# Altium project 华南师范控制板.PrjPcb
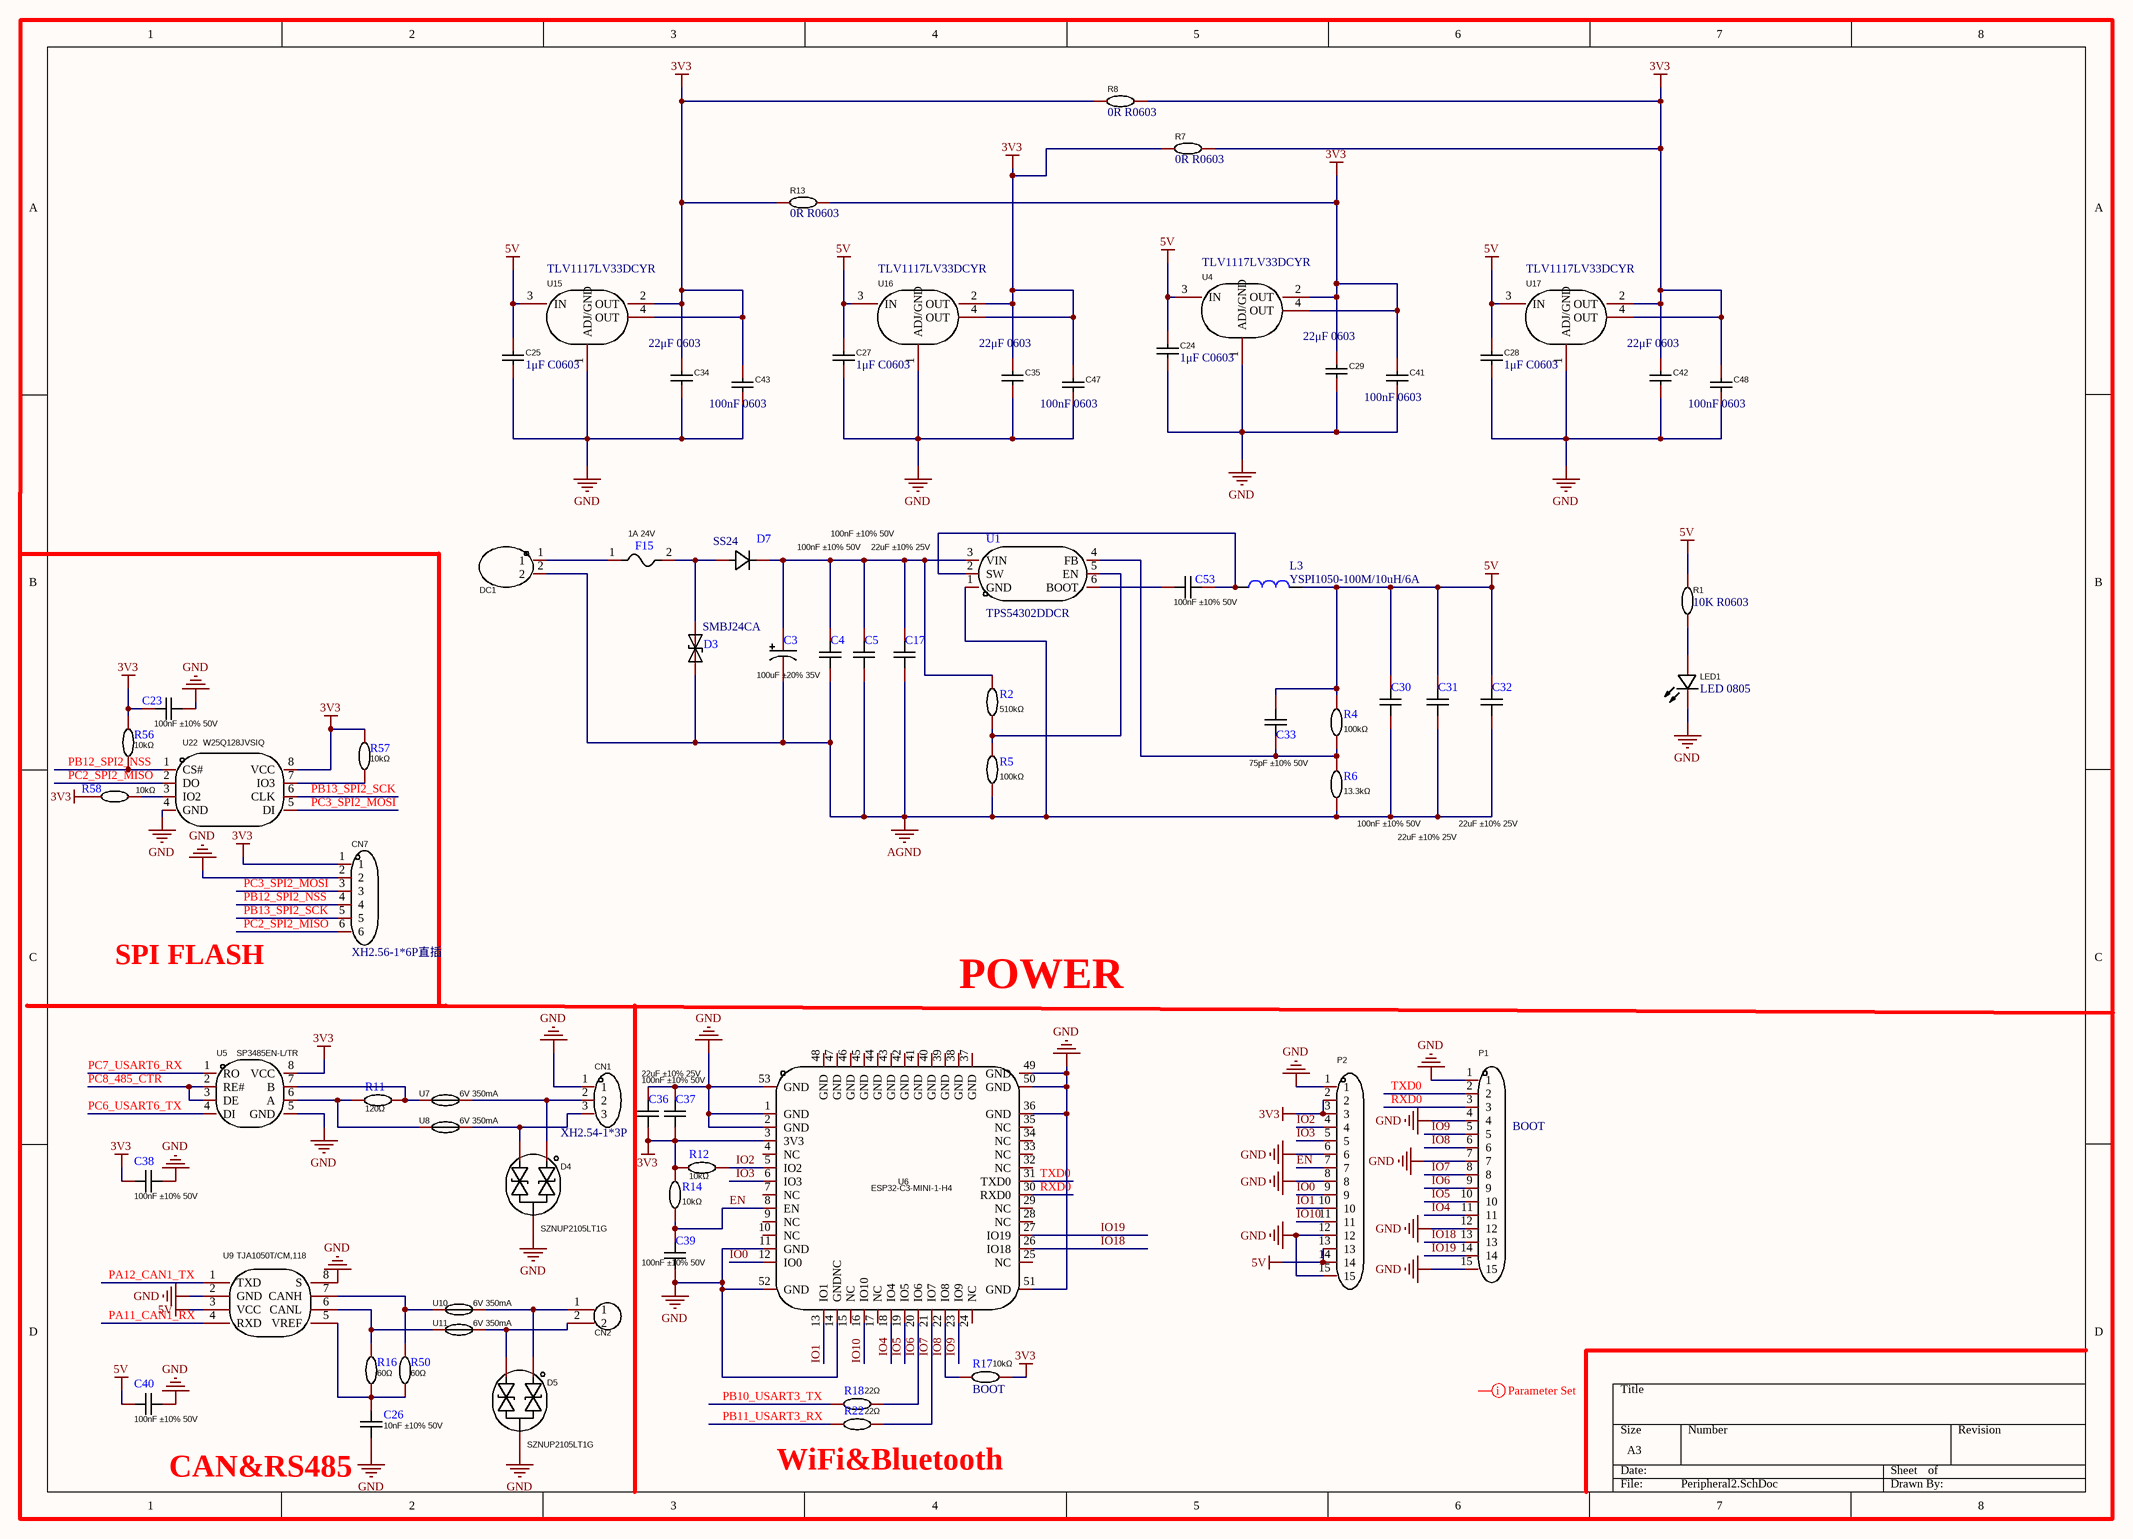
[diagram p0: Peripheral2.SchDoc]
2 sheets, 171 parts. Net scope: global (net labels, ports and power ports of the same name join across sheets).
Board files: MainMaster20230302.PcbDoc, 2.0原生完整板MainMaster20230302.PcbDoc, MainMaster20230708.PcbDoc
Sheets:
  Peripheral2.SchDoc
  MainMaster.SchDoc

## Sheet Peripheral2.SchDoc
size A3; PageSetup: Record=PageOptions|CenterHorizontal=True|CenterVertical=True|PrintScale=0.97|XCorrection=1.00|YCorrection=1.00|PrintKind=0|BorderSize=5000000|LeftOffset=0|BottomOffset=0|Orientation=2|PaperLength=1000|PaperWidth=1000|Scale=100|PaperSource=7|PrintQuality=-4|MediaType=1|DitherType=10|PrintScaleMode=1|PaperKind=A4|PaperIndex=9

### Parts
C3  LCSC Part Name: 100uF ±20% 35V  [CE 6.3*7.7]  (hidden comment: VES101M1VTR-0607)
C4  LCSC Part Name: 100nF ±10% 50V  [C0603]  (hidden comment: CC0603KRX7R9BB104)
C5  LCSC Part Name: 100nF ±10% 50V  [C0603]  (hidden comment: CC0603KRX7R9BB104)
C17  LCSC Part Name: 22uF ±10% 25V  [C1210]  (hidden comment: CC0603KRX7R9BB104)
C23  LCSC Part Name: 100nF ±10% 50V  [C0603]  (hidden comment: CC0603KRX7R9BB104)
C24  1μF C0603  [C0603]
C25  1μF C0603  [C0603]
C26  LCSC Part Name: 10nF ±10% 50V  [C0603]  (hidden comment: CC0603KRX7R9BB104)
C27  1μF C0603  [C0603]
C28  1μF C0603  [C0603]
C29  22μF 0603  [C0603]
C30  LCSC Part Name: 100nF ±10% 50V  [C0603]  (hidden comment: CC0603KRX7R9BB104)
C31  LCSC Part Name: 22uF ±10% 25V  [C1210]  (hidden comment: CC0603KRX7R9BB104)
C32  LCSC Part Name: 22uF ±10% 25V  [C1210]  (hidden comment: CC0603KRX7R9BB104)
C33  LCSC Part Name: 75pF ±10% 50V  [C0603]  (hidden comment: CC0603KRX7R9BB104)
C34  22μF 0603  [C0603]
C35  22μF 0603  [C0603]
C36  LCSC Part Name: 22uF ±10% 25V  [C1210]  (hidden comment: CC0603KRX7R9BB104)
C37  LCSC Part Name: 100nF ±10% 50V  [C0603]  (hidden comment: CC0603KRX7R9BB104)
C38  LCSC Part Name: 100nF ±10% 50V  [C0603]  (hidden comment: CC0603KRX7R9BB104)
C39  LCSC Part Name: 100nF ±10% 50V  [C0603]  (hidden comment: CC0603KRX7R9BB104)
C40  LCSC Part Name: 100nF ±10% 50V  [C0603]  (hidden comment: CC0603KRX7R9BB104)
C41  100nF 0603  [C0603]
C42  22μF 0603  [C0603]
C43  100nF 0603  [C0603]
C47  100nF 0603  [C0603]
C48  100nF 0603  [C0603]
C53  LCSC Part Name: 100nF ±10% 50V  [C0603]  (hidden comment: CC0603KRX7R9BB104)
CN1  XH2.54-1*3P  [XH2.54-1*3P-CONN-TH_3P-P2.50_HC-XH-3A-G]
CN2  XH-2A_C20079  [XH2.5-2]  (value not drawn)
CN7  XH2.56-1*6P直插  [H2.54-1*6P-直插CONN-TH_6P-P2.50_HC-XH-6A-G]
D3  SMBJ24CA  [SMB]
D4  SZNUP2105LT1G  [SOT-23]
D5  SZNUP2105LT1G  [SOT-23]
D7  SS24  [SMA]
DC1  A3963WV-2P  [CONN-TH_A3963WV-2P]  (value not drawn)
F15  LCSC Part Name: 1A 24V  [F1206]  (hidden comment: TLC-NSMD100/24)
L3  YSPI1050-100M/10uH/6A  [IND-SMD_L11.5-W10.0_SMMS1040]
LED1  LED 0805  [LED0805-RD_RED]
P1  KH-2.54FH-1X15P-H8.5  [HDR2.54-M-LI-15P]  (value not drawn)
P2  KH-2.54FH-1X15P-H8.5  [HDR2.54-M-LI-15P]  (value not drawn)
R1  10K R0603  [R0603]
R2  value 510kΩ  [R0603]  (hidden comment: 0603WAF5113T5E)
R4  value 100kΩ  [R0603]  (hidden comment: 0603WAF5113T5E)
R5  value 100kΩ  [R0603]  (hidden comment: 0603WAF5113T5E)
R6  value 13.3kΩ  [R0603]  (hidden comment: 0603WAF5113T5E)
R7  0R R0603  [R0603]
R8  0R R0603  [R0603]
R11  value 120Ω  [R0603]  (hidden comment: 0603WAF5113T5E)
R12  value 10kΩ  [R0603]  (hidden comment: 0603WAF5113T5E)
R13  0R R0603  [R0603]
R14  value 10kΩ  [R0603]  (hidden comment: 0603WAF5113T5E)
R16  value 60Ω  [R0603]  (hidden comment: 0603WAF5113T5E)
R17  value 10kΩ  [R0603]  (hidden comment: 0603WAF5113T5E)
R18  value 22Ω  [R0603]  (hidden comment: 0603WAF5113T5E)
R22  value 22Ω  [R0603]  (hidden comment: 0603WAF5113T5E)
R50  value 60Ω  [R0603]  (hidden comment: 0603WAF5113T5E)
R56  value 10kΩ  [R0603]  (hidden comment: 0603WAF5113T5E)
R57  value 10kΩ  [R0603]  (hidden comment: 0603WAF5113T5E)
R58  value 10kΩ  [R0603]  (hidden comment: 0603WAF5113T5E)
U1  TPS54302DDCR  [SOT23-6]
U4  TLV1117LV33DCYR  [1117LV-SOT-223_L6.7-W3.5-P2.30-BR]
U5  SP3485EN-L/TR  [SOP8_SP3485]
U6  ESP32-C3-MINI-1-H4  [WIFIM-SMD_ESP32-C3-MINI-1]
U7  LCSC Part Name: 6V 350mA  [F0603]  (hidden comment: 0603L035YR)
U8  LCSC Part Name: 6V 350mA  [F0603]  (hidden comment: 0603L035YR)
U9  TJA1050T/CM,118  [SOP8_TJA1050]
U10  LCSC Part Name: 6V 350mA  [F0603]  (hidden comment: 0603L035YR)
U11  LCSC Part Name: 6V 350mA  [F0603]  (hidden comment: 0603L035YR)
U15  TLV1117LV33DCYR  [1117LV-SOT-223_L6.7-W3.5-P2.30-BR]
U16  TLV1117LV33DCYR  [1117LV-SOT-223_L6.7-W3.5-P2.30-BR]
U17  TLV1117LV33DCYR  [1117LV-SOT-223_L6.7-W3.5-P2.30-BR]
U22  W25Q128JVSIQ  [SOIC8]

### Nets
3V3: C23.2 C29.2 C34.2 C35.2 C36.1 C37.1 C38.2 C41.2 C42.2 C43.2 C47.2 C48.2 CN7.1 P2.2 P2.3 R7.1 R7.2 R8.1 R8.2 R12.2 R13.1 R13.2 R14.2 R17.1 R56.1 R57.1 R58.2 U4.2(OUT) U4.4(OUT) U5.8(VCC) U6.3(3V3) U15.2(OUT) U15.4(OUT) U16.2(OUT) U16.4(OUT) U17.2(OUT) U17.4(OUT) U22.8(VCC)
5V: C24.2 C25.2 C27.2 C28.2 C30.2 C31.2 C32.2 C33.2 C40.2 L3.2 P2.13 P2.14 R1.2 R4.2 U4.3(IN) U9.3(VCC) U15.3(IN) U16.3(IN) U17.3(IN)
AGND: C3.2 C4.1 C5.1 C17.1 C23.1 C24.1 C25.1 C26.2 C27.1 C28.1 C29.1 C30.1 C31.1 C32.1 C34.1 C35.1 C36.2 C37.2 C38.1 C39.1 C40.1 C41.1 C42.1 C43.1 C47.1 C48.1 CN1.1 CN7.2 D3.2(A) D4.3 D5.3 DC1.2 LED1.1(-) P1.1 P1.4 P1.7 P1.12 P1.15 P2.1 P2.6 P2.8 P2.12 P2.15 R5.1 R6.1 U1.1(GND) U4.1(ADJ/GND) U5.5(GND) U6.1(GND) U6.2(GND) U6.11(GND) U6.14(GNDNC) U6.36(GND) U6.49(GND) U6.50(GND) U6.51(GND) U6.52(GND) U6.53(GND) U9.2(GND) U9.8(S) U15.1(ADJ/GND) U16.1(ADJ/GND) U17.1(ADJ/GND) U22.4(GND)  [also labelled GND]
EN: C39.2 P2.7 R14.1 U6.8(EN)
IO0: P2.9 U6.12(IO0)
IO1: P2.10 U6.13(IO1)
IO2: P2.4 R12.1 U6.5(IO2)
IO3: P2.5 U6.6(IO3)
IO4: P1.11 U6.18(IO4)
IO5: P1.10 U6.19(IO5)
IO6: P1.9 R18.1 U6.20(IO6)
IO7: P1.8 R22.1 U6.21(IO7)
IO8: P1.6 R17.2 U6.22(IO8)
IO9: P1.5 U6.23(IO9)
IO10: P2.11 U6.16(IO10)
IO18: P1.13 U6.26(IO18)
IO19: P1.14 U6.27(IO19)
PA11_CAN1_RX: U9.4(RXD)
PA12_CAN1_TX: U9.1(TXD)
PB10_USART3_TX: R18.2
PB11_USART3_RX: R22.2
PB12_SPI2_NSS: CN7.4 R56.2 U22.1(CS#)
PB13_SPI2_SCK: CN7.5 U22.6(CLK)
PC2_SPI2_MISO: CN7.6 U22.2(DO)
PC3_SPI2_MOSI: CN7.3 U22.5(DI)
PC6_USART6_TX: U5.4(DI)
PC7_USART6_RX: U5.1(RO)
PC8_485_CTR: U5.2(RE#) U5.3(DE)
RXD0: P1.3 U6.30(RXD0)
TXD0: P1.2 U6.31(TXD0)
NetC3_1: C3.1 C4.2 C5.2 C17.2 D7.1(K) R2.2 U1.3(VIN)
NetC26_1: C26.1 R16.2 R50.2 U9.5(VREF)
NetC33_1: C33.1 R4.1 R6.2 U1.4(FB)
NetC53_1: C53.1 L3.1 U1.2(SW)
NetC53_2: C53.2 U1.6(BOOT)
NetCN1_2: CN1.2 D4.1 U7.2
NetCN1_3: CN1.3 D4.2 U8.2
NetCN2_1: CN2.1 D5.1 U10.2
NetCN2_2: CN2.2 D5.2 U11.2
NetD3_1: D3.1(K) D7.2(A) F15.2
NetDC1_1: DC1.1 F15.1
NetLED1_2: LED1.2(+) R1.1
NetR2_1: R2.1 R5.2 U1.5(EN)
NetR11_1: R11.1 U5.7(B) U7.1
NetR11_2: R11.2 U5.6(A) U8.1
NetR16_1: R16.1 U9.6(CANL) U11.1
NetR50_1: R50.1 U9.7(CANH) U10.1
NetR57_2: R57.2 U22.7(IO3)
NetR58_1: R58.1 U22.3(IO2)

Not connected (* = marked no-connect by the designer): U6 4(NC) 7(NC) 9(NC) 10(NC) 15(NC) 17(NC) 24(NC) 25(NC) 28(NC) 29(NC) 32(NC) 33(NC) 34(NC) 35(NC) 37(GND) 38(GND) 39(GND) 40(GND) 41(GND) 42(GND) 43(GND) 44(GND) 45(GND) 46(GND) 47(GND) 48(GND)

### Notes on the sheet
- SPI FLASH
- POWER
- (near P1) BOOT
- (near R17) BOOT
- (near R22) WiFi&Bluetooth
- CAN&RS485

### Library data of the parts
C3 = VES101M1VTR-0607: Manufacturer: lelon(立隆); Name: 100uF; Add into BOM: yes; Value: 100uF; Tolerance: ±20%; Rated Voltage: 35V; φD: 6.3mm; L: 7.7mm; Lifetime @ Temp: 1000hrs@105℃; Symbol: VES101M1VTR-0607; Device: VES101M1VTR-0607; Supplier Part: C134792; Manufacturer Part: VES101M1VTR-0607; Supplier Footprint: SMD,6.3x7.7mm; JLCPCB Part Class: Extended Part; Datasheet: https://atta.szlcsc.com/upload/public/pdf/source/20171023/C134792_15087477404271052916.pdf; Supplier: LCSC; Convert to PCB: yes; Ripple Current: -; Equivalent Series Resistance(ESR): -; Operating Temperature: -45℃~+105℃
C4 C5 C17 C23 C26 C30-C33 C36-C40 C53 = CC0603KRX7R9BB104: Manufacturer: YAGEO(国巨); Name: 100nF; Add into BOM: yes; Value: 100nF; Tolerance: ±10%; Voltage Rated: 50V; Temperature Coefficient: X7R; Symbol: CC0603KRX7R9BB104; Device: CC0603KRX7R9BB104; Supplier Part: C14663; Manufacturer Part: CC0603KRX7R9BB104; Supplier Footprint: 0603; JLCPCB Part Class: Basic Part; Datasheet: https://atta.szlcsc.com/upload/public/pdf/source/20170116/1484561234239.pdf; Supplier: LCSC; Convert to PCB: yes
C24 C25 C27-C29 C34 C35 C42 = C0805: X7R/X5R，额定电压>=25,精度=10%; Manufacturer: FH(风华); Name: 100nF; Symbol: 0805B104K500NT; Add into BOM: yes; Value: 100nF; Tolerance: ±10%; Voltage Rated: 50V; Temperature Coefficient: X7R; Device: 0805B104K500NT; LCSC Part Name: 100nF ±10% 50V; Supplier Part: C38141; Manufacturer Part: 0805B104K500NT; Supplier Footprint: 0805; JLCPCB Part Class: Extended Part; Datasheet: https://atta.szlcsc.com/upload/public/pdf/source/20170923/C38141_1506149447419988747.pdf; Supplier: LCSC; Convert to PCB: yes
C41 C43 C47 C48 = C0805: X7R/X5R，额定电压>=25,精度=10%; Manufacturer: FH(风华); Symbol: 0805B104K500NT; Add into BOM: yes; Tolerance: ±10%; Voltage Rated: 50V; Temperature Coefficient: X7R; Name: 100nF; Device: 0805B104K500NT; LCSC Part Name: 100nF ±10% 50V; Supplier Part: C38141; Manufacturer Part: 0805B104K500NT; Supplier Footprint: 0805; JLCPCB Part Class: Extended Part; Datasheet: https://atta.szlcsc.com/upload/public/pdf/source/20170923/C38141_1506149447419988747.pdf; Supplier: LCSC; Convert to PCB: yes; Value: 100nF
CN1 = XH2.54-1*3P: 直插; Manufacturer: HCTL(华灿天禄); Name: HC-XH-3A-G; Add into BOM: yes; Reference Series: XH; Pitch: 2.54mm; Pins Structure: 1x3P; Number of PINs Per Row: 3; Gender: 公型插针; Current Rating (Max): 3A; Symbol: HC-XH-3A-G; Device: HC-XH-3A-G; LCSC Part Name: XH 2.54mm 1x3P 直插; Supplier Part: C5341202; Manufacturer Part: HC-XH-3A-G; Supplier Footprint: 插件,P=2.5mm; JLCPCB Part Class: Extended Part; Datasheet: https://atta.szlcsc.com/upload/public/pdf/source/20230105/4FFD2EFD3DA44AA828171A44400F3EDE.pdf; Supplier: LCSC; Convert to PCB: yes; Number of Rows: 1; Row Spacing: 2.54mm; Mounting Style: 直插; Operating Temperature Range: -25℃~+85℃; link: https://atta.szlcsc.com/upload/public/pdf/source/20230105/4FFD2EFD3DA44AA828171A44400F3EDE.pdf
CN2 = XH-2A_C20079: Manufacturer: BOOMELE(博穆精密); Name: XH-2A; Add into BOM: yes; Reference Series: XH; Pitch: 2.5mm; Pins Structure: 1x2P; Number of PINs Per Row: 2; Symbol: XH-2A; Device: XH-2A_C20079; LCSC Part Name: XH-2A,2P,脚距2.5mm,直插; Supplier Part: C20079; Manufacturer Part: XH-2A; Supplier Footprint: 插件,P=2.5mm; JLCPCB Part Class: Extended Part; Datasheet: https://atta.szlcsc.com/upload/public/pdf/source/20151225/1457707654857.pdf; Supplier: LCSC; Convert to PCB: yes; Number of Rows: 1; Row Spacing: -; Mounting Style: -; Contact Material: -
CN7 = XH2.56-1*6P直插: Manufacturer: HCTL(华灿天禄); Name: HC-XH-6AW-G; Add into BOM: yes; Reference Series: XH; Pitch: 2.54mm; Pins Structure: 1x6P; Number of PINs Per Row: 6; Gender: 公型插针; Current Rating (Max): 3A; Symbol: HC-XH-6AW-G; Device: HC-XH-6AW-G; LCSC Part Name: XH 2.54mm 1x6P 弯插; Supplier Part: C5341212; Manufacturer Part: HC-XH-6AW-G; Supplier Footprint: 弯插,P=2.5mm; Datasheet: https://atta.szlcsc.com/upload/public/pdf/source/20230105/4FFD2EFD3DA44AA828171A44400F3EDE.pdf; Supplier: LCSC; Convert to PCB: yes; Number of Rows: 1; Row Spacing: 2.54mm; Mounting Style: 弯插; Operating Temperature Range: -25℃~+85℃
D3 = SMBJ24CA_C78416: Manufacturer: Brightking(君耀电子); Add into BOM: yes; Polarity: 双向; Reverse Stand-Off Voltage (Vrwm): 24V; Breakdown Voltage (Min): 26.7V; Peak Pulse Current (Ipp)@10/1000μs: 15.5A; Maximum Clamping Voltage: 38.9V; Name: SMBJ24CA; Symbol: SMBJ24CA_C78416; Device: SMBJ24CA_C78416; LCSC Part Name: 双向 Vrwm:24V; Supplier Part: C78416; Manufacturer Part: SMBJ24CA; Supplier Footprint: SMB(DO-214AA); JLCPCB Part Class: Extended Part; Datasheet: https://atta.szlcsc.com/upload/public/pdf/source/20160709/1468031885392.pdf; Supplier: LCSC; Convert to PCB: yes
D4 D5 = SZNUP2105LT1G: Manufacturer: onsemi(安森美); Add into BOM: yes; Name: SZNUP2105LT1G; Symbol: SZNUP2105LT1G; Device: SZNUP2105LT1G; LCSC Part Name: SZNUP2105LT1G; Supplier Part: C233494; Manufacturer Part: SZNUP2105LT1G; Supplier Footprint: SOT-23-3; JLCPCB Part Class: Extended Part; Datasheet: https://atta.szlcsc.com/upload/public/pdf/source/20180829/C233494_96D7515346DCD494B58AEC5F0195E5EF.pdf; Supplier: LCSC; Convert to PCB: yes
D7 = SS24_C2829443: Manufacturer: CJ(江苏长电/长晶); Add into BOM: yes; Diode Configuration: 独立式; Reverse Voltage (Vr): 40V; Average Rectified Current (Io): 2A; Forward Voltage (Vf@If): 550mV@2A; Reverse Leakage Current (Ir): 500uA@40V; Name: SS24; Symbol: SS24_C2829443; Device: SS24_C2829443; LCSC Part Name: 40V 2A 550mV@2A; Supplier Part: C2829443; Manufacturer Part: SS24; Supplier Footprint: SMAG; JLCPCB Part Class: Extended Part; Datasheet: https://atta.szlcsc.com/upload/public/pdf/source/20211215/D3A84FE1ADED5816729B4A876C7DC644.pdf; Supplier: LCSC; Convert to PCB: yes
DC1 = A3963WV-2P: Manufacturer: CJT(长江连接器); Add into BOM: yes; Reference Series: VH; Pitch: 3.96mm; Pins Structure: 1x2P; Number of PINs Per Row: 2; Name: A3963WV-2P; Symbol: A3963WV-2P; Device: A3963WV-2P; LCSC Part Name: VH 3.96mm 1x2P; Supplier Part: C239409; Manufacturer Part: A3963WV-2P; Supplier Footprint: 插件,P=3.96mm; JLCPCB Part Class: Extended Part; Datasheet: https://atta.szlcsc.com/upload/public/pdf/source/20230105/6EEAD9731438ED12835B23C71AA3398A.pdf; Supplier: LCSC; Convert to PCB: yes; Number of Rows: 1; Row Spacing: -; Mounting Style: -; Contact Material: 黄铜
F15 = TLC-NSMD100/24: Manufacturer: TLC(竞沃); Add into BOM: yes; Operating Voltage (Max): 24V; Current Rating (Max): 100A; Hold Current: 1A; Trip Current: 2A; Power Dissipation: 600mW; Resistance - Initial (Ri) (Min): 60mΩ; Resistance - Post Trip (R1) (Max): 280mΩ; Maximum Time to Trip: 100ms; Name: TLC-NSMD100/24; Symbol: TLC-NSMD100/24; Device: TLC-NSMD100/24; Supplier Part: C2924939; Manufacturer Part: TLC-NSMD100/24; Supplier Footprint: 1206; JLCPCB Part Class: Extended Part; Datasheet: https://atta.szlcsc.com/upload/public/pdf/source/20211202/9DD64AE932171F6A930B1738394E7F41.pdf; Supplier: LCSC; Convert to PCB: yes; Operating Temperature: -
L3 = INDUCTOR
LED1 = LED 0805: LED 0805-NCD0805R1; Manufacturer: 国星光电; Symbol: FC-2012HRK-620D; Add into BOM: yes; Illumination Color: 红色; Luminous Intensity (IF=20mA): 67~195mcd; Dominant Wavelength / Coordinate rank: 615~630nm; Name: NCD0805R1; Device: NCD0805R1; LCSC Part Name: 红灯 0805 贴片LED; Supplier Part: C84256; Manufacturer Part: NCD0805R1; Supplier Footprint: 0805; JLCPCB Part Class: Basic Part; Datasheet: https://atta.szlcsc.com/upload/public/pdf/source/20200820/C84256_F0A75A43B3EAD75808600A0514C76B99.pdf; Supplier: LCSC; Convert to PCB: yes; Mounting Type: 表面贴装
P1 P2 = KH-2.54FH-1X15P-H8.5: Manufacturer: kinghelm(金航标); Add into BOM: yes; Pitch: 2.54mm; Number of Holes: 15; Holes Structure: 1x15P; Circular Hole / Square Hole: 方孔; Current Rating (Max): 3A; Holes Direction: 顶部; Name: KH-2.54FH-1X15P-H8.5; Symbol: KH-2.54FH-1X15P-H8.5; Device: KH-2.54FH-1X15P-H8.5; LCSC Part Name: 2.54mm 1x15P; Supplier Part: C2932676; Manufacturer Part: KH-2.54FH-1X15P-H8.5; Supplier Footprint: 直插,P=2.54mm; JLCPCB Part Class: Extended Part; Datasheet: https://atta.szlcsc.com/upload/public/pdf/source/20211220/977AA415CFA981E866620A80068F25CA.pdf; Supplier: LCSC; Convert to PCB: yes; Number of Rows: 1; Row Spacing: -; Mounting Type: 直插; Voltage Rating (Max): -; Insulation Height: 8.5mm; Operating Temperature Range: -40℃~+105℃
R1 R7 R8 R13 = R0603: Manufacturer: YAGEO(国巨); Name: 68Ω; Symbol: RC0805FR-0768RL; Add into BOM: yes; Value: 68Ω; Tolerance: ±1%; Power(Watts): 125mW; Temperature Coefficient: ±100ppm/℃; Overload Voltage (Max): 150V; Device: RC0805FR-0768RL; LCSC Part Name: 68Ω ±1% 125mW; Supplier Part: C137498; Manufacturer Part: RC0805FR-0768RL; Supplier Footprint: 0805; JLCPCB Part Class: Extended Part; Datasheet: https://atta.szlcsc.com/upload/public/pdf/source/20171106/C137498_15099604779991093655.pdf; Supplier: LCSC; Convert to PCB: yes; Type: 厚膜电阻; Operating Temperature Range: -55℃~+125℃
R2 R4-R6 R11 R12 R14 R16-R18 R22 R50 R56-R58 = 0603WAF5113T5E: Manufacturer: UNI-ROYAL(厚声); Add into BOM: yes; Tolerance: ±1%; Power(Watts): 100mW; Temperature Coefficient: ±100ppm/℃; Overload Voltage (Max): 75V; Symbol: 0603WAF5113T5E; Device: 0603WAF5113T5E; LCSC Part Name: 511kΩ ±1% 100mW; Supplier Part: C23194; Manufacturer Part: 0603WAF5113T5E; Supplier Footprint: 0603; JLCPCB Part Class: Extended Part; Datasheet: https://atta.szlcsc.com/upload/public/pdf/source/20200306/C422600_1E6D84923E4A46A82E41ADD87F860B5C.pdf; Supplier: LCSC; Convert to PCB: yes; Type: 厚膜电阻; Operating Temperature Range: -55℃~+155℃
  R2: Name: 510kΩ
  R4 R5: Name: 100kΩ
  R6: Name: 13.3kΩ
  R11: Name: 120Ω
  R12 R14 R17 R56-R58: Name: 10kΩ
  R16 R50: Name: 60Ω
  R18 R22: Name: 22Ω
U1 = TPS54302DDCR: Manufacturer: TI(德州仪器); Symbol: TPS54302DDCR_C311983; Add into BOM: yes; Function: 降压型; Synchronous Rectification: 是; Output Type: 可调; Number of Outputs: 1; Topology: 降压式; Input Voltage: 4.5V~28V; Output Voltage: 596mV~28V; Output Current (Max): 3A; Switching Frequency: 400kHz; Name: TPS54302DDCR; Device: TPS54302DDCR; LCSC Part Name: 降压型 Vin=4.5V~28V Vout=596mV~28V 3A; Supplier Part: C311983; Manufacturer Part: TPS54302DDCR; Supplier Footprint: TSOT-23-6; JLCPCB Part Class: Extended Part; Datasheet: https://atta.szlcsc.com/upload/public/pdf/source/20181023/C311983_0948EE70BFAD2011B492BD3F4CEA709D.pdf; Supplier: LCSC; Convert to PCB: yes; Operating Temperature: -40℃~+125℃@(TJ)
U4 U15-U17 = TLV1117LV33DCYR: C15578 // SOT-223// TI; Manufacturer: TI(德州仪器); Add into BOM: yes; Output Type: 固定; Output Polarity: 正; Number of Outputs: 1; Maximum Input Voltage: 5.5V; Output Voltage: 3.3V; Dropout Voltage: 1.3V@(800mA); Output Current: 1A; Power Supply Rejection Ratio (PSRR): 75dB@(120Hz); Name: TLV1117LV33DCYR; Symbol: TLV1117LV33DCYR; Device: TLV1117LV33DCYR; LCSC Part Name: 正 Vin=5.5V Vout=3.3V 1A 75dB@(120Hz); Supplier Part: C15578; Manufacturer Part: TLV1117LV33DCYR; Supplier Footprint: SOT-223; JLCPCB Part Class: Extended Part; Datasheet: https://atta.szlcsc.com/upload/public/pdf/source/20140704/1457707105729.pdf; Supplier: LCSC; Convert to PCB: yes
U5 = SP3485EN-L/TR: Manufacturer: MaxLinear; Add into BOM: yes; Types: 收发器; Driver/receiver: 1/1; Data Rate: 10Mbps; Supply Voltage: 3.3V; Name: SP3485EN-L/TR; Symbol: SP3485EN-L/TR; Device: SP3485EN-L/TR; LCSC Part Name: 10Mbps; Supplier Part: C8963; Manufacturer Part: SP3485EN-L/TR; Supplier Footprint: SOIC-8_150mil; JLCPCB Part Class: Basic Part; Datasheet: https://atta.szlcsc.com/upload/public/pdf/source/20170601/1496285796963.pdf; Supplier: LCSC; Convert to PCB: yes
U6 = ESP32-C3-MINI-1U-H4: Manufacturer: ESPRESSIF(乐鑫); Add into BOM: yes; Name: ESP32-C3-MINI-1-H4; Symbol: ESP32-C3-MINI-1-H4; Device: ESP32-C3-MINI-1-H4; LCSC Part Name: ESP32-C3-MINI-1-H4; Supplier Part: C2934569; Manufacturer Part: ESP32-C3-MINI-1-H4; Supplier Footprint: 模块; JLCPCB Part Class: Extended Part; Datasheet: https://atta.szlcsc.com/upload/public/pdf/source/20220602/2F3F799AD033675D9930B69B0B580EA8.pdf; Supplier: LCSC; Convert to PCB: yes
U7 U8 U10 U11 = 0603L035YR: Manufacturer: Littelfuse(美国力特); Add into BOM: yes; Operating Voltage (Max): 6V; Current Rating (Max): 40A; Hold Current: 350mA; Trip Current: 750mA; Resistance - Initial (Ri) (Min): 200mΩ; Resistance - Post Trip (R1) (Max): 1Ω; Maximum Time to Trip: 100ms; Name: 0603L035YR; Symbol: 0603L035YR; Device: 0603L035YR; Supplier Part: C207013; Manufacturer Part: 0603L035YR; Supplier Footprint: 0603; JLCPCB Part Class: Extended Part; Datasheet: https://atta.szlcsc.com/upload/public/pdf/source/20180709/C207013_44786F09EAFC890D8A7C29FA56404C7F.pdf; Supplier: LCSC; Convert to PCB: yes; Power Dissipation: -; Operating Temperature: -40℃~+85℃
U9 = TJA1050T/CM,118: Manufacturer: NXP(恩智浦); Add into BOM: yes; Protocol: CAN总线; Supply Voltage: 4.75V ~ 5.25V; Name: TJA1050T/CM,118; Symbol: TJA1050T/CM,118; Device: TJA1050T/CM,118; LCSC Part Name: TJA1050T/CM,118; Supplier Part: C6952; Manufacturer Part: TJA1050T/CM,118; Supplier Footprint: SOIC-8_150mil; JLCPCB Part Class: Basic Part; Datasheet: https://atta.szlcsc.com/upload/public/pdf/source/20140411/1457707042917.pdf; Supplier: LCSC; Convert to PCB: yes; Type: 收发器
U22 = W25Q128JVSIQ: Manufacturer: WINBOND(华邦); Symbol: W25Q128JVSIQTR; Add into BOM: yes; Memory Format: FLASH; Memory Interface: SPI - Dual/Quad I/O; Memory Size: 128Mb (16M x 8); Voltage - Supply: 2.7V ~ 3.6V; Name: W25Q128JVSIQ; Device: W25Q128JVSIQ; LCSC Part Name: W25Q128JVSIQ; Supplier Part: C97521; Manufacturer Part: W25Q128JVSIQ; Supplier Footprint: SOIC-8_208mil; JLCPCB Part Class: Basic Part; Datasheet: https://atta.szlcsc.com/upload/public/pdf/source/20170316/1489627409956.pdf; Supplier: LCSC; Convert to PCB: yes

## Sheet MainMaster.SchDoc
size A3; PageSetup: Record=PageOptions|CenterHorizontal=True|CenterVertical=True|PrintScale=0.71|XCorrection=1.00|YCorrection=1.00|PrintKind=0|BorderSize=5000000|LeftOffset=0|BottomOffset=0|Orientation=2|PaperLength=1000|PaperWidth=1000|Scale=100|PaperSource=7|PrintQuality=-4|MediaType=1|DitherType=10|PrintScaleMode=1|PaperKind=A4|PaperIndex=9
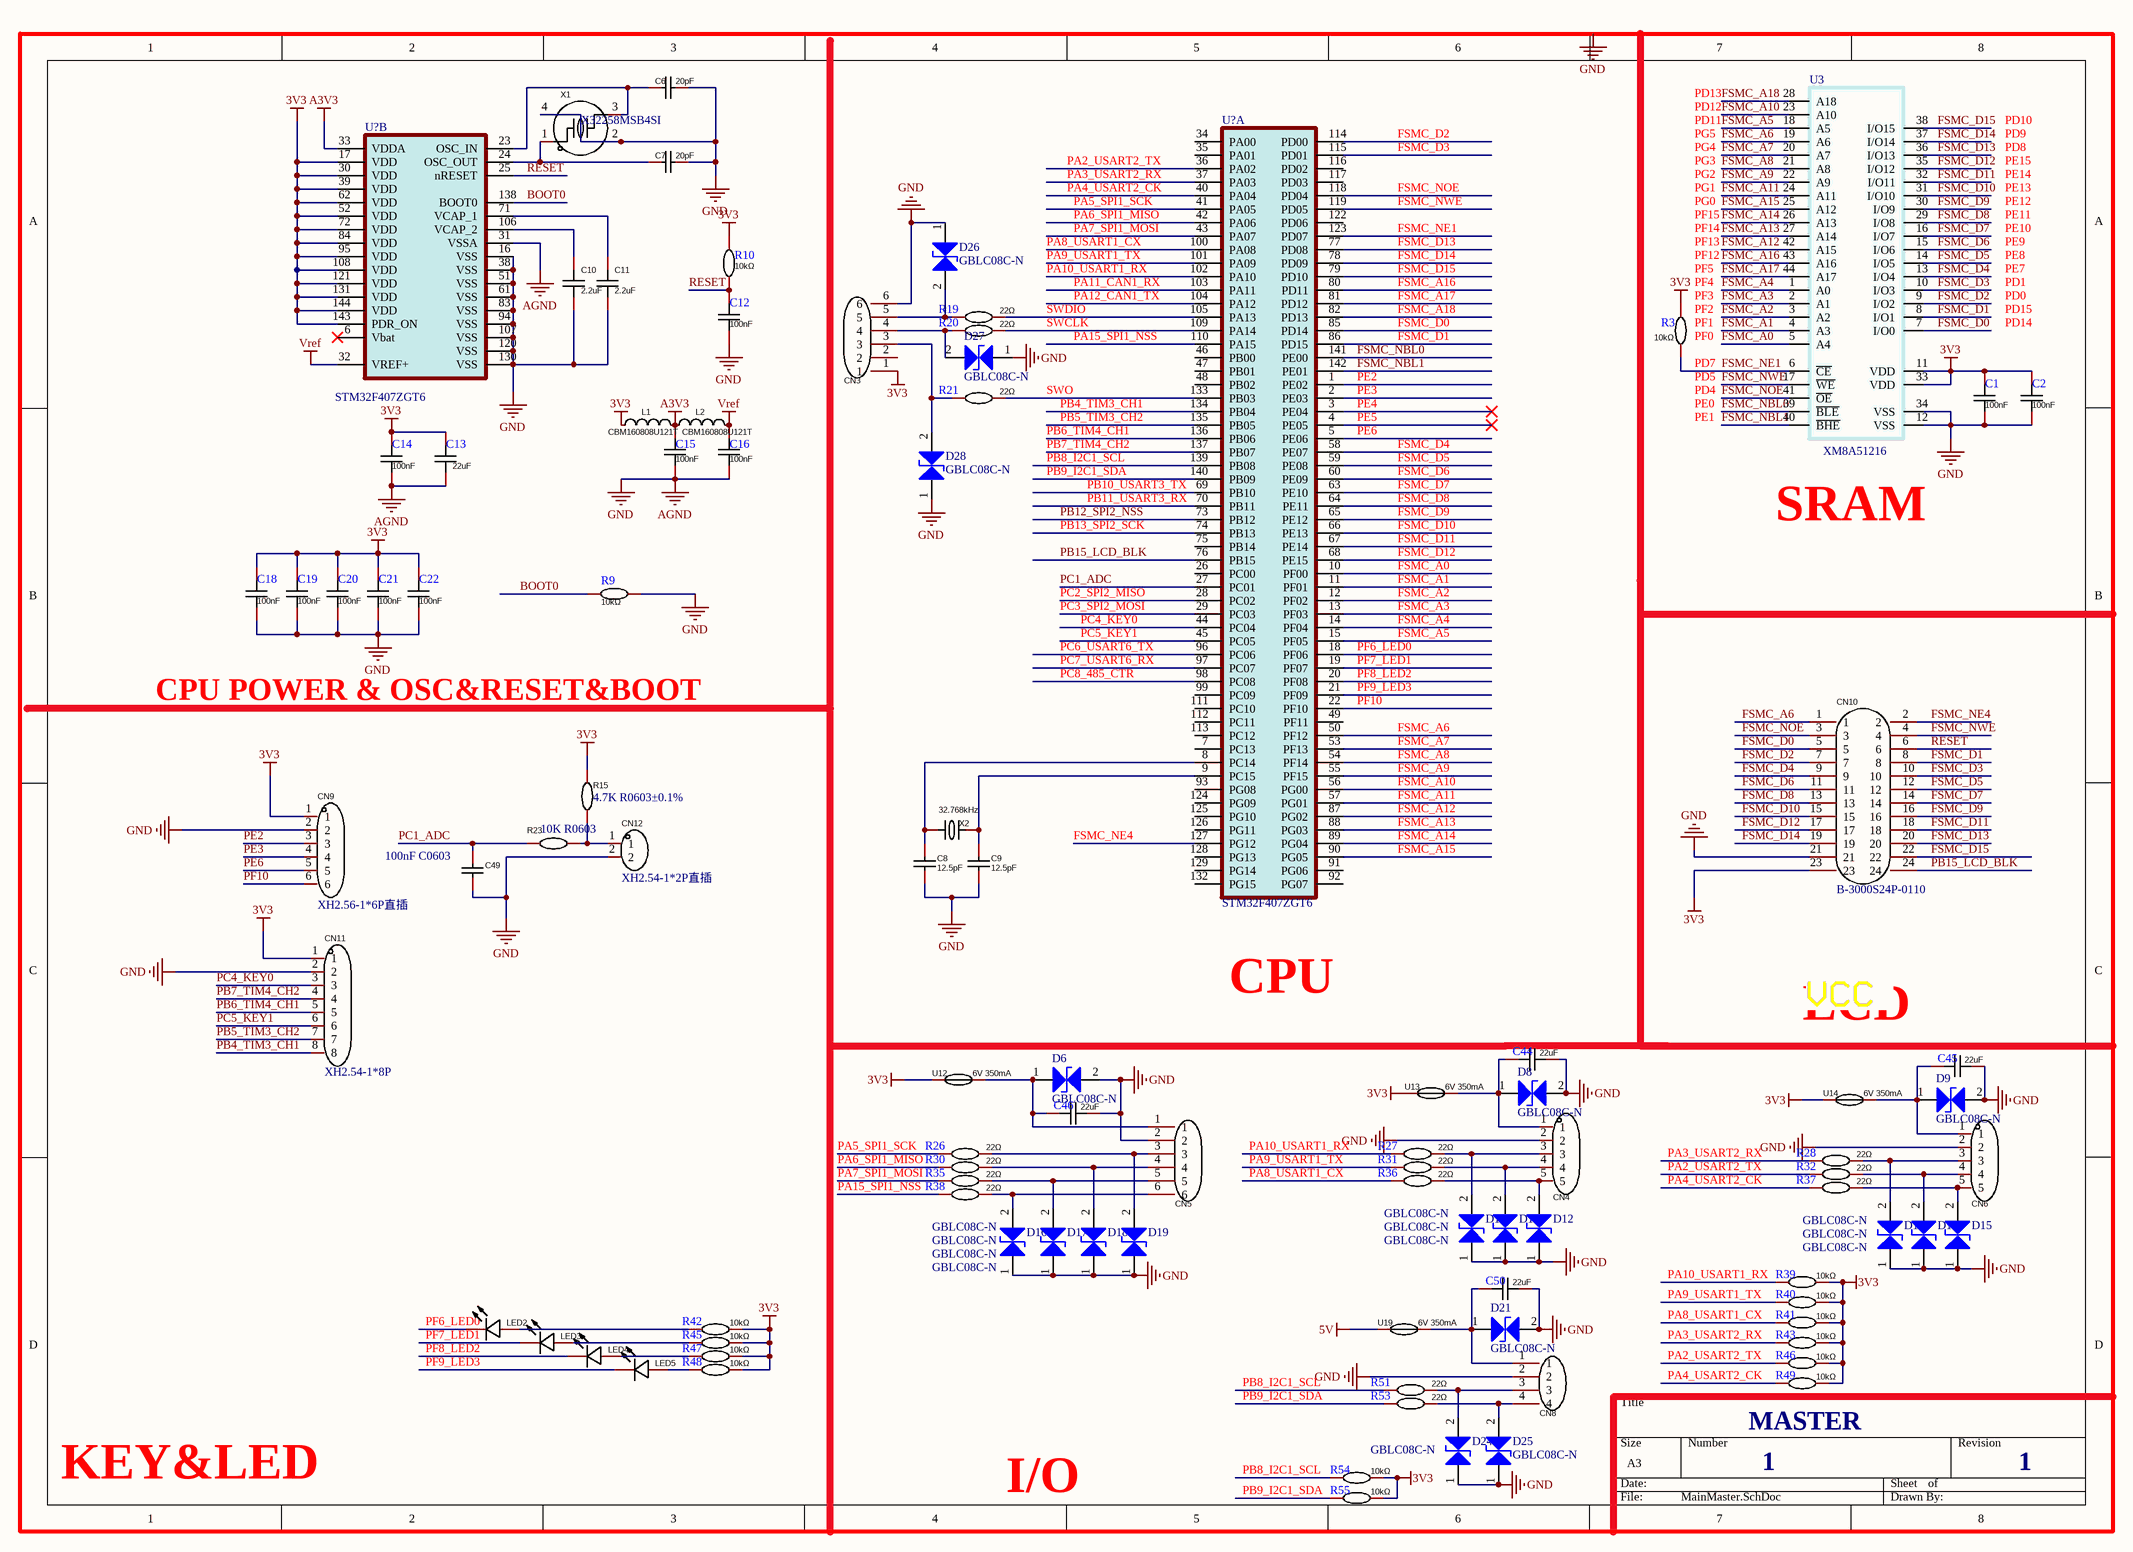
[diagram p1: MainMaster.SchDoc]

### Parts
(Parts that share a designator on the sheet are numbered #1, #2 ... from top to bottom, then left to right.)
C1  Name: 100nF  [C0603]  (hidden comment: CC0603KRX7R9BB104)
C2  Name: 100nF  [C0603]  (hidden comment: CC0603KRX7R9BB104)
C6  Name: 20pF  [C0603]  (hidden comment: CC0603JRNPO9BN200)
C7  Name: 20pF  [C0603]  (hidden comment: CC0603JRNPO9BN200)
C8  Name: 12.5pF  [C0603]  (hidden comment: CC0603JRNPO9BN200)
C9  Name: 12.5pF  [C0603]  (hidden comment: CC0603JRNPO9BN200)
C10  Name: 2.2uF  [C0603]  (hidden comment: CL10A225KA8NNNC)
C11  Name: 2.2uF  [C0603]  (hidden comment: CL10A225KA8NNNC)
C12  Name: 100nF  [C0603]  (hidden comment: CC0603KRX7R9BB104)
C13  Name: 22uF  [C1210]  (hidden comment: CC0603KRX7R9BB104)
C14  Name: 100nF  [C0603]  (hidden comment: CC0603KRX7R9BB104)
C15  Name: 100nF  [C0603]  (hidden comment: CC0603KRX7R9BB104)
C16  Name: 100nF  [C0603]  (hidden comment: CC0603KRX7R9BB104)
C18  Name: 100nF  [C0603]  (hidden comment: CC0603KRX7R9BB104)
C19  Name: 100nF  [C0603]  (hidden comment: CC0603KRX7R9BB104)
C20  Name: 100nF  [C0603]  (hidden comment: CC0603KRX7R9BB104)
C21  Name: 100nF  [C0603]  (hidden comment: CC0603KRX7R9BB104)
C22  Name: 100nF  [C0603]  (hidden comment: CC0603KRX7R9BB104)
C44  Name: 22uF  [C1210]  (hidden comment: CC0603KRX7R9BB104)
C45  Name: 22uF  [C1210]  (hidden comment: CC0603KRX7R9BB104)
C46  Name: 22uF  [C1210]  (hidden comment: CC0603KRX7R9BB104)
C49  100nF C0603  [C0603]
C50  Name: 22uF  [C1210]  (hidden comment: CC0603KRX7R9BB104)
CN3  XH-6A  [XH2.5-6P]  (value not drawn)
CN4  XH-5A  [XH2.5-5P]  (value not drawn)
CN5  XH-6A  [XH2.5-6P]  (value not drawn)
CN6  XH-5A  [XH2.5-5P]  (value not drawn)
CN8  XH-4A  [XH2.5-4P]  (value not drawn)
CN9  XH2.56-1*6P直插  [H2.54-1*6P-直插CONN-TH_6P-P2.50_HC-XH-6A-G]
CN10  B-3000S24P-0110  [牛角座2*12P-CONN-TH_300S-24P]
CN11  XH2.54-1*8P  [XH2.54-1*8P-CONN-TH_8P-P2.50_HC-XH-8A-G]
CN12  XH2.54-1*2P直插  [XH2.54-1*2P 直插CONN-TH_2P-P2.50_HC-XH-2A-G]
D6  GBLC08C-N  [SOD-323_L1.8-W1.3-LS2.5-BI]
D8  GBLC08C-N  [SOD-323_L1.8-W1.3-LS2.5-BI]
D9  GBLC08C-N  [SOD-323_L1.8-W1.3-LS2.5-BI]
D10  GBLC08C-N  [SOD-323_L1.8-W1.3-LS2.5-BI]
D11  GBLC08C-N  [SOD-323_L1.8-W1.3-LS2.5-BI]
D12  GBLC08C-N  [SOD-323_L1.8-W1.3-LS2.5-BI]
D13  GBLC08C-N  [SOD-323_L1.8-W1.3-LS2.5-BI]
D14  GBLC08C-N  [SOD-323_L1.8-W1.3-LS2.5-BI]
D15  GBLC08C-N  [SOD-323_L1.8-W1.3-LS2.5-BI]
D16  GBLC08C-N  [SOD-323_L1.8-W1.3-LS2.5-BI]
D17  GBLC08C-N  [SOD-323_L1.8-W1.3-LS2.5-BI]
D18  GBLC08C-N  [SOD-323_L1.8-W1.3-LS2.5-BI]
D19  GBLC08C-N  [SOD-323_L1.8-W1.3-LS2.5-BI]
D21  GBLC08C-N  [SOD-323_L1.8-W1.3-LS2.5-BI]
D24  GBLC08C-N  [SOD-323_L1.8-W1.3-LS2.5-BI]
D25  GBLC08C-N  [SOD-323_L1.8-W1.3-LS2.5-BI]
D26  GBLC08C-N  [SOD-323_L1.8-W1.3-LS2.5-BI]
D27  GBLC08C-N  [SOD-323_L1.8-W1.3-LS2.5-BI]
D28  GBLC08C-N  [SOD-323_L1.8-W1.3-LS2.5-BI]
L1  CBM160808U121T  [L0603]
L2  CBM160808U121T  [L0603]
LED2  17-21SYGC/S530-E3/TR8  [LED 0805G]  (value not drawn)
LED3  17-21SYGC/S530-E3/TR8  [LED 0805G]  (value not drawn)
LED4  17-21SYGC/S530-E3/TR8  [LED 0805G]  (value not drawn)
LED5  17-21SYGC/S530-E3/TR8  [LED 0805G]  (value not drawn)
R3  value 10kΩ  [R0603]  (hidden comment: 0603WAF5113T5E)
R9  value 10kΩ  [R0603]  (hidden comment: 0603WAF5113T5E)
R10  value 10kΩ  [R0603]  (hidden comment: 0603WAF5113T5E)
R15  4.7K R0603±0.1%  [R0603]
R19  value 22Ω  [R0603]  (hidden comment: 0603WAF5113T5E)
R20  value 22Ω  [R0603]  (hidden comment: 0603WAF5113T5E)
R21  value 22Ω  [R0603]  (hidden comment: 0603WAF5113T5E)
R23  10K R0603  [R0603]
R26  value 22Ω  [R0603]  (hidden comment: 0603WAF5113T5E)
R27  value 22Ω  [R0603]  (hidden comment: 0603WAF5113T5E)
R28  value 22Ω  [R0603]  (hidden comment: 0603WAF5113T5E)
R30  value 22Ω  [R0603]  (hidden comment: 0603WAF5113T5E)
R31  value 22Ω  [R0603]  (hidden comment: 0603WAF5113T5E)
R32  value 22Ω  [R0603]  (hidden comment: 0603WAF5113T5E)
R35  value 22Ω  [R0603]  (hidden comment: 0603WAF5113T5E)
R36  value 22Ω  [R0603]  (hidden comment: 0603WAF5113T5E)
R37  value 22Ω  [R0603]  (hidden comment: 0603WAF5113T5E)
R38  value 22Ω  [R0603]  (hidden comment: 0603WAF5113T5E)
R39  value 10kΩ  [R0603]  (hidden comment: 0603WAF5113T5E)
R40  value 10kΩ  [R0603]  (hidden comment: 0603WAF5113T5E)
R41  value 10kΩ  [R0603]  (hidden comment: 0603WAF5113T5E)
R42  value 10kΩ  [R0603]  (hidden comment: 0603WAF5113T5E)
R43  value 10kΩ  [R0603]  (hidden comment: 0603WAF5113T5E)
R45  value 10kΩ  [R0603]  (hidden comment: 0603WAF5113T5E)
R46  value 10kΩ  [R0603]  (hidden comment: 0603WAF5113T5E)
R47  value 10kΩ  [R0603]  (hidden comment: 0603WAF5113T5E)
R48  value 10kΩ  [R0603]  (hidden comment: 0603WAF5113T5E)
R49  value 10kΩ  [R0603]  (hidden comment: 0603WAF5113T5E)
R51  value 22Ω  [R0603]  (hidden comment: 0603WAF5113T5E)
R53  value 22Ω  [R0603]  (hidden comment: 0603WAF5113T5E)
R54  value 10kΩ  [R0603]  (hidden comment: 0603WAF5113T5E)
R55  value 10kΩ  [R0603]  (hidden comment: 0603WAF5113T5E)
U3  XM8A51216  [IS62WV51216BLL_TSOP44]
U12  LCSC Part Name: 6V 350mA  [F0603]  (hidden comment: 0603L035YR)
U13  LCSC Part Name: 6V 350mA  [F0603]  (hidden comment: 0603L035YR)
U14  LCSC Part Name: 6V 350mA  [F0603]  (hidden comment: 0603L035YR)
U19  LCSC Part Name: 6V 350mA  [F0603]  (hidden comment: 0603L035YR)
U?#1  STM32F407ZGT6  [STM32F407ZET6_TQFP144]  (part A of 2)
U?#2  STM32F407ZGT6  [STM32F407ZET6_TQFP144]  (part B of 2)
X1  X32258MSB4SI  [OSC 3225-4P]
X2  Name: 32.768kHz  [CR_3215_32768]  (hidden comment: X321532768KGD2SI)

### Nets
3V3: C1.2 C2.2 C13.2 C14.2 C18.2 C19.2 C20.2 C21.2 C22.2 CN3.1 CN9.1 CN10.23 CN11.1 L1.1 R3.2 R10.1 R15.2 R39.1 R40.1 R41.1 R42.1 R43.1 R45.1 R46.1 R47.1 R48.1 R49.1 R54.1 R55.1 U3.11(VDD) U3.33(VDD) U12.1 U13.1 U14.1 U?#2.17(VDD) U?#2.30(VDD) U?#2.39(VDD) U?#2.52(VDD) U?#2.62(VDD) U?#2.72(VDD) U?#2.84(VDD) U?#2.95(VDD) U?#2.108(VDD) U?#2.121(VDD) U?#2.131(VDD) U?#2.143(PDR_ON) U?#2.144(VDD)
5V: U19.1
A3V3: C15.2 L1.2 L2.1 U?#2.33(VDDA)
AGND: C1.1 C2.1 C6.2 C7.2 C8.1 C9.1 C10.1 C11.1 C12.1 C13.1 C14.1 C15.1 C16.1 C18.1 C19.1 C20.1 C21.1 C22.1 C44.1 C45.1 C46.1 C49.1 C50.1 CN3.6 CN4.2 CN5.2 CN6.2 CN8.2 CN9.2 CN10.21 CN11.2 CN12.2 D6.2(K) D8.2(K) D9.2(K) D10.1(A) D11.1(A) D12.1(A) D13.1(A) D14.1(A) D15.1(A) D16.1(A) D17.1(A) D18.1(A) D19.1(A) D21.2(K) D24.1(A) D25.1(A) D26.1(A) D27.1(A) D28.1(A) R9.2 U3.12(VSS) U3.34(VSS) U?#2.16(VSS) U?#2.31(VSSA) U?#2.38(VSS) U?#2.51(VSS) U?#2.61(VSS) U?#2.83(VSS) U?#2.94(VSS) U?#2.107(VSS) U?#2.120(VSS) U?#2.130(VSS) X1.2(GND) X1.4(GND)  [also labelled GND]
Vref: C16.2 L2.2 U?#2.32(VREF+)
BOOT0: R9.1 U?#2.138(BOOT0)
FSMC_A0: U3.5(A4) U?#1.10(PF00)
FSMC_A1: U3.4(A3) U?#1.11(PF01)
FSMC_A2: U3.3(A2) U?#1.12(PF02)
FSMC_A3: U3.2(A1) U?#1.13(PF03)
FSMC_A4: U3.1(A0) U?#1.14(PF04)
FSMC_A5: U3.18(A5) U?#1.15(PF05)
FSMC_A6: CN10.1 U3.19(A6) U?#1.50(PF12)
FSMC_A7: U3.20(A7) U?#1.53(PF13)
FSMC_A8: U3.21(A8) U?#1.54(PF14)
FSMC_A9: U3.22(A9) U?#1.55(PF15)
FSMC_A10: U3.23(A10) U?#1.56(PG00)
FSMC_A11: U3.24(A11) U?#1.57(PG01)
FSMC_A12: U3.42(A15) U?#1.87(PG02)
FSMC_A13: U3.27(A14) U?#1.88(PG03)
FSMC_A14: U3.26(A13) U?#1.89(PG04)
FSMC_A15: U3.25(A12) U?#1.90(PG05)
FSMC_A16: U3.43(A16) U?#1.80(PD11)
FSMC_A17: U3.44(A17) U?#1.81(PD12)
FSMC_A18: U3.28(A18) U?#1.82(PD13)
FSMC_D0: CN10.5 U3.7(I/O0) U?#1.85(PD14)
FSMC_D1: CN10.8 U3.8(I/O1) U?#1.86(PD15)
FSMC_D2: CN10.7 U3.9(I/O2) U?#1.114(PD00)
FSMC_D3: CN10.10 U3.10(I/O3) U?#1.115(PD01)
FSMC_D4: CN10.9 U3.13(I/O4) U?#1.58(PE07)
FSMC_D5: CN10.12 U3.14(I/O5) U?#1.59(PE08)
FSMC_D6: CN10.11 U3.15(I/O6) U?#1.60(PE09)
FSMC_D7: CN10.14 U3.16(I/O7) U?#1.63(PE10)
FSMC_D8: CN10.13 U3.29(I/O8) U?#1.64(PE11)
FSMC_D9: CN10.16 U3.30(I/O9) U?#1.65(PE12)
FSMC_D10: CN10.15 U3.31(I/O10) U?#1.66(PE13)
FSMC_D11: CN10.18 U3.32(I/O11) U?#1.67(PE14)
FSMC_D12: CN10.17 U3.35(I/O12) U?#1.68(PE15)
FSMC_D13: CN10.20 U3.36(I/O13) U?#1.77(PD08)
FSMC_D14: CN10.19 U3.37(I/O14) U?#1.78(PD09)
FSMC_D15: CN10.22 U3.38(I/O15) U?#1.79(PD10)
FSMC_NBL0: U3.39(~{BLE}) U?#1.141(PE00)
FSMC_NBL1: U3.40(~{BHE}) U?#1.142(PE01)
FSMC_NE1: R3.1 U3.6(~{CE}) U?#1.123(PD07)
FSMC_NE4: CN10.2 U?#1.127(PG12)
FSMC_NOE: CN10.3 U3.41(~{OE}) U?#1.118(PD04)
FSMC_NWE: CN10.4 U3.17(~{WE}) U?#1.119(PD05)
PA2_USART2_TX: R32.2 R46.2 U?#1.36(PA02)
PA3_USART2_RX: R28.2 R43.2 U?#1.37(PA03)
PA4_USART2_CK: R37.2 R49.2 U?#1.40(PA04)
PA5_SPI1_SCK: R26.2 U?#1.41(PA05)
PA6_SPI1_MISO: R30.2 U?#1.42(PA06)
PA7_SPI1_MOSI: R35.2 U?#1.43(PA07)
PA8_USART1_CX: R36.2 R41.2 U?#1.100(PA08)
PA9_USART1_TX: R31.2 R40.2 U?#1.101(PA09)
PA10_USART1_RX: R27.2 R39.2 U?#1.102(PA10)
PA11_CAN1_RX: U?#1.103(PA11)
PA12_CAN1_TX: U?#1.104(PA12)
PA15_SPI1_NSS: R38.2 U?#1.110(PA15)
PB4_TIM3_CH1: CN11.8 U?#1.134(PB04)
PB5_TIM3_CH2: CN11.7 U?#1.135(PB05)
PB6_TIM4_CH1: CN11.5 U?#1.136(PB06)
PB7_TIM4_CH2: CN11.4 U?#1.137(PB07)
PB8_I2C1_SCL: R51.2 R54.2 U?#1.139(PB08)
PB9_I2C1_SDA: R53.2 R55.2 U?#1.140(PB09)
PB10_USART3_TX: U?#1.69(PB10)
PB11_USART3_RX: U?#1.70(PB11)
PB12_SPI2_NSS: U?#1.73(PB12)
PB13_SPI2_SCK: U?#1.74(PB13)
PB15_LCD_BLK: CN10.24 U?#1.76(PB15)
PC1_ADC: C49.2 R23.1 U?#1.27(PC01)
PC2_SPI2_MISO: U?#1.28(PC02)
PC3_SPI2_MOSI: U?#1.29(PC03)
PC4_KEY0: CN11.3 U?#1.44(PC04)
PC5_KEY1: CN11.6 U?#1.45(PC05)
PC6_USART6_TX: U?#1.96(PC06)
PC7_USART6_RX: U?#1.97(PC07)
PC8_485_CTR: U?#1.98(PC08)
PE2: CN9.3 U?#1.1(PE02)
PE3: CN9.4 U?#1.2(PE03)
PE4: U?#1.3(PE04)
PE5: U?#1.4(PE05)
PE6: CN9.5 U?#1.5(PE06)
PF6_LED0: LED2.1(K) U?#1.18(PF06)
PF7_LED1: LED3.1(K) U?#1.19(PF07)
PF8_LED2: LED4.1(K) U?#1.20(PF08)
PF9_LED3: LED5.1(K) U?#1.21(PF09)
PF10: CN9.6 U?#1.22(PF10)
RESET: C12.2 CN10.6 R10.2 U?#2.25(nRESET)
SWCLK: R20.1 U?#1.109(PA14)
SWDIO: R19.1 U?#1.105(PA13)
SWO: R21.1 U?#1.133(PB03)
NetC6_1: C6.1 U?#2.23(OSC_IN) X1.3
NetC7_1: C7.1 U?#2.24(OSC_OUT) X1.1
NetC8_2: C8.2 U?#1.8(PC14) X2.1
NetC9_2: C9.2 U?#1.9(PC15) X2.2
NetC10_2: C10.2 U?#2.106(VCAP_2)
NetC11_2: C11.2 U?#2.71(VCAP_1)
NetC44_2: C44.2 CN4.1 D8.1(A) U13.2
NetC45_2: C45.2 CN6.1 D9.1(A) U14.2
NetC46_2: C46.2 CN5.1 D6.1(A) U12.2
NetC50_2: C50.2 CN8.1 D21.1(A) U19.2
NetCN3_3: CN3.3 D28.2(K) R21.2
NetCN3_4: CN3.4 D27.2(K) R20.2
NetCN3_5: CN3.5 D26.2(K) R19.2
NetCN4_3: CN4.3 D10.2(K) R27.1
NetCN4_4: CN4.4 D11.2(K) R31.1
NetCN4_5: CN4.5 D12.2(K) R36.1
NetCN5_3: CN5.3 D19.2(K) R26.1
NetCN5_4: CN5.4 D18.2(K) R30.1
NetCN5_5: CN5.5 D17.2(K) R35.1
NetCN5_6: CN5.6 D16.2(K) R38.1
NetCN6_3: CN6.3 D13.2(K) R28.1
NetCN6_4: CN6.4 D14.2(K) R32.1
NetCN6_5: CN6.5 D15.2(K) R37.1
NetCN8_3: CN8.3 D24.2(K) R51.1
NetCN8_4: CN8.4 D25.2(K) R53.1
NetCN12_1: CN12.1 R15.1 R23.2
NetLED2_2: LED2.2(A) R42.2
NetLED3_2: LED3.2(A) R45.2
NetLED4_2: LED4.2(A) R47.2
NetLED5_2: LED5.2(A) R48.2

Not connected (* = marked no-connect by the designer): CN3 2; U?#1 7(PC13) 26(PC00) 34(PA00) 35(PA01) 46(PB00) 47(PB01) 48(PB02) 49(PF11) 75(PB14) 91(PG06) 92(PG07) 93(PG08) 99(PC09) 111(PC10) 112(PC11) 113(PC12) 116(PD02) 117(PD03) 122(PD06) 124(PG09) 125(PG10) 126(PG11) 128(PG13) 129(PG14) 132(PG15); U?#2 6(Vbat)*

### Notes on the sheet
- PG5
- PD11
- PD12
- PD13
- PD9
- PD10
- PG0
- PG1
- PG2
- PG3
- PG4
- PE12
- PE13
- PE14
- PE15
- PD8
- (near R3) PF5
- PF12
- PF13
- PF14
- PF15
- PE7
- PE8
- PE9
- PE10
- PE11
- (near R3) PF0
- (near R3) PF1
- (near R3) PF2
- (near R3) PF3
- (near R3) PF4
- PD14
- PD15
- PD0
- PD1
- (near R3) PD7
- (near R3) PD5
- (near R3) PD4
- PE0
- PE1
- (near U3) SRAM
- CPU POWER & OSC&RESET&BOOT
- CPU
- LCD
- KEY&LED
- (near R49) MASTER
- 1
- I/O
- Labels drawn without touching a wire or pin: GND

### Library data of the parts
C1 C2 C12 C14-C16 C18-C22 = CC0603KRX7R9BB104: Manufacturer: YAGEO(国巨); Add into BOM: yes; Value: 100nF; Tolerance: ±10%; Voltage Rated: 50V; Temperature Coefficient: X7R; Symbol: CC0603KRX7R9BB104; Device: CC0603KRX7R9BB104; LCSC Part Name: 100nF ±10% 50V; Supplier Part: C14663; Manufacturer Part: CC0603KRX7R9BB104; Supplier Footprint: 0603; JLCPCB Part Class: Basic Part; Datasheet: https://atta.szlcsc.com/upload/public/pdf/source/20170116/1484561234239.pdf; Supplier: LCSC; Convert to PCB: yes
C6 C7 = CC0603JRNPO9BN200: Manufacturer: YAGEO(国巨); Add into BOM: yes; Value: 20pF; Tolerance: ±5%; Voltage Rated: 50V; Temperature Coefficient: NP0; Symbol: CC0603JRNPO9BN200; Device: CC0603JRNPO9BN200; LCSC Part Name: 20pF ±5% 50V; Supplier Part: C105621; Manufacturer Part: CC0603JRNPO9BN200; Supplier Footprint: 0603; JLCPCB Part Class: Extended Part; Datasheet: https://atta.szlcsc.com/upload/public/pdf/source/20170425/1493115771885.pdf; Supplier: LCSC; Convert to PCB: yes
C8 C9 = CC0603JRNPO9BN200: Manufacturer: YAGEO(国巨); Add into BOM: yes; Value: 12.5pF; Tolerance: ±5%; Voltage Rated: 50V; Temperature Coefficient: NP0; Symbol: CC0603JRNPO9BN200; Device: CC0603JRNPO9BN200; LCSC Part Name: 12.5pF ±5% 50V; Supplier Part: C105621; Manufacturer Part: CC0603JRNPO9BN200; Supplier Footprint: 0603; JLCPCB Part Class: Extended Part; Datasheet: https://atta.szlcsc.com/upload/public/pdf/source/20170425/1493115771885.pdf; Supplier: LCSC; Convert to PCB: yes
C10 C11 = CL10A225KA8NNNC: Manufacturer: SAMSUNG(三星); Add into BOM: yes; Value: 2.2uF; Tolerance: ±10%; Voltage Rated: 25V; Temperature Coefficient: X5R; Symbol: CL10A225KA8NNNC; Device: CL10A225KA8NNNC; LCSC Part Name: 2.2uF ±10% 25V; Supplier Part: C57895; Manufacturer Part: CL10A225KA8NNNC; Supplier Footprint: 0603; JLCPCB Part Class: Extended Part; Datasheet: https://atta.szlcsc.com/upload/public/pdf/source/20170325/1490427872398.pdf; Supplier: LCSC; Convert to PCB: yes
C13 C44-C46 C50 = CC0603KRX7R9BB104: Manufacturer: YAGEO(国巨); Add into BOM: yes; Value: 22uF; Tolerance: ±10%; Voltage Rated: 50V; Temperature Coefficient: X7R; Symbol: CC0603KRX7R9BB104; Device: CC0603KRX7R9BB104; LCSC Part Name: 22uF ±10% 25V; Supplier Part: C14663; Manufacturer Part: CC0603KRX7R9BB104; Supplier Footprint: 0603; JLCPCB Part Class: Basic Part; Datasheet: https://atta.szlcsc.com/upload/public/pdf/source/20170116/1484561234239.pdf; Supplier: LCSC; Convert to PCB: yes
C49 = C0603: X7R/X5R，额定电压>=25,精度=10%; Manufacturer: FH(风华); Symbol: 0805B104K500NT; Add into BOM: yes; Tolerance: ±10%; Voltage Rated: 50V; Temperature Coefficient: X7R; Name: 100nF; Device: 0805B104K500NT; LCSC Part Name: 100nF ±10% 50V; Supplier Part: C38141; Manufacturer Part: 0805B104K500NT; Supplier Footprint: 0805; JLCPCB Part Class: Extended Part; Datasheet: https://atta.szlcsc.com/upload/public/pdf/source/20170923/C38141_1506149447419988747.pdf; Supplier: LCSC; Convert to PCB: yes; Value: 100nF
CN3 CN5 = XH-6A: Manufacturer: BOOMELE(博穆精密); Add into BOM: yes; Reference Series: XH; Pitch: 2.5mm; Pins Structure: 1x6P; Number of PINs Per Row: 6; Name: XH-6A; Symbol: XH-6A; Device: XH-6A; LCSC Part Name: XH-6A,6P,脚距2.5mm,直插 直插; Supplier Part: C5663; Manufacturer Part: XH-6A; Supplier Footprint: 插件,P=2.5mm; JLCPCB Part Class: Extended Part; Datasheet: https://atta.szlcsc.com/upload/public/pdf/source/20151222/1457707648819.pdf; Supplier: LCSC; Convert to PCB: yes; Number of Rows: 1; Row Spacing: -; Mounting Style: -; Contact Material: -
CN4 CN6 = XH-5A: Manufacturer: BOOMELE(博穆精密); Add into BOM: yes; Reference Series: XH; Pitch: 2.5mm; Pins Structure: 1x5P; Number of PINs Per Row: 5; Name: XH-5A; Symbol: XH-5A; Device: XH-5A; LCSC Part Name: XH-5A,5P,脚距2.5mm,直插; Supplier Part: C2318; Manufacturer Part: XH-5A; Supplier Footprint: 插件,P=2.5mm; JLCPCB Part Class: Extended Part; Datasheet: https://atta.szlcsc.com/upload/public/pdf/source/20151222/1457707640907.pdf; Supplier: LCSC; Convert to PCB: yes; Number of Rows: 1; Row Spacing: -; Mounting Style: -; Contact Material: -
CN8 = XH-4A: Manufacturer: BOOMELE(博穆精密); Add into BOM: yes; Reference Series: XH; Pitch: 2.5mm; Pins Structure: 1x4P; Number of PINs Per Row: 4; Name: XH-4A; Symbol: XH-4A; Device: XH-4A; LCSC Part Name: XH-4A,4P,脚距2.5mm,直插 直插; Supplier Part: C37815; Manufacturer Part: XH-4A; Supplier Footprint: 插件,P=2.5mm; JLCPCB Part Class: Extended Part; Datasheet: https://atta.szlcsc.com/upload/public/pdf/source/20170919/C37815_1505787307039977083.pdf; Supplier: LCSC; Convert to PCB: yes; Number of Rows: 1; Row Spacing: -; Mounting Style: -; Contact Material: 磷青铜
CN9 = XH2.56-1*6P直插: as CN7 on sheet Peripheral2; Symbol: HC-XH-6AW-G; Device: HC-XH-6AW-G; LCSC Part Name: XH 2.54mm 1x6P 弯插; Supplier Part: C5341212; Manufacturer Part: HC-XH-6AW-G; Supplier Footprint: 弯插,P=2.5mm; Datasheet: https://atta.szlcsc.com/upload/public/pdf/source/20230105/4FFD2EFD3DA44AA828171A44400F3EDE.pdf; Supplier: LCSC; Convert to PCB: yes; Number of Rows: 1; Row Spacing: 2.54mm; Mounting Style: 弯插; Operating Temperature Range: -25℃~+85℃
CN10 = 牛角座-2*12p: 牛角座-2*12p 直插 C132440; Manufacturer: Ckmtw(灿科盟); Symbol: 300S-24P; Add into BOM: yes; Connector Type: 简牛座; Pin Number in each Row: 12; Pitch: 2.54mm; Name: B-3000S24P-0110; Device: B-3000S24P-0110; LCSC Part Name: 每排P数:12 排数:2 2.54mm 300系列; Supplier Part: C132440; Manufacturer Part: B-3000S24P-0110; Supplier Footprint: 插件,P=2.54mm; JLCPCB Part Class: Extended Part; Datasheet: https://atta.szlcsc.com/upload/public/pdf/source/20180105/C132440_15151572266231234450.pdf; Supplier: LCSC; Convert to PCB: yes; Number of Rows: 2; Row Spacing: 2.54mm; Holder Type: 直插; Contact Material: 黄铜; Contact Plating: 金
CN11 = XH2.54-1*8P: XH2.54-1*8P//直插//C5341207; Manufacturer: HCTL(华灿天禄); Name: HC-XH-8A-G; Add into BOM: yes; Reference Series: XH; Pitch: 2.54mm; Pins Structure: 1x8P; Number of PINs Per Row: 8; Gender: 公型插针; Current Rating (Max): 3A; Symbol: HC-XH-8A-G; Device: HC-XH-8A-G; LCSC Part Name: 2.5mm 1x8P 直插; Supplier Part: C5341207; Manufacturer Part: HC-XH-8A-G; Supplier Footprint: 直插,P=2.5mm; JLCPCB Part Class: Extended Part; Datasheet: https://atta.szlcsc.com/upload/public/pdf/source/20230105/4FFD2EFD3DA44AA828171A44400F3EDE.pdf; Supplier: LCSC; Convert to PCB: yes; Number of Rows: 1; Row Spacing: 2.54mm; Mounting Style: 直插; Operating Temperature Range: -25℃~+85℃
CN12 = XH2.54-1*2P: Manufacturer: HCTL(华灿天禄); Name: HC-XH-2A-G; Add into BOM: yes; Reference Series: XH; Pitch: 2.54mm; Pins Structure: 1x2P; Number of PINs Per Row: 2; Gender: 公型插针; Current Rating (Max): 3A; Symbol: HC-XH-2A-G; Device: HC-XH-2A-G; LCSC Part Name: XH 2.5mm 1x2P 直插 白色耐温; Supplier Part: C5341201; Manufacturer Part: HC-XH-2A-G; Supplier Footprint: 直插,P=2.5mm; JLCPCB Part Class: Extended Part; Datasheet: https://atta.szlcsc.com/upload/public/pdf/source/20230105/4FFD2EFD3DA44AA828171A44400F3EDE.pdf; Supplier: LCSC; Convert to PCB: yes; Number of Rows: 1; Row Spacing: 2.54mm; Mounting Style: 直插; Operating Temperature Range: -25℃~+85℃
D6 D8-D19 D21 D24-D28 = 09.04.00336: LXES1UTAA1-157,0402,MURATA; Manufacturer: BORN伯恩半导体; Add into BOM: yes; Polarity: Bidirectional; Voltage - Reverse Standoff (Typ): 8V (Max); Voltage - Breakdown (Min): 9V; Voltage - Clamping (Max) @ Ipp: 27V; Current - Peak Pulse (10/1000μs): 15A (8/20us); Name: GBLC08C-N; Symbol: GBLC08C-N; Device: GBLC08C-N; LCSC Part Name: GBLC08C-N; Supplier Part: C314256; Manufacturer Part: GBLC08C-N; Supplier Footprint: SOD-323; JLCPCB Part Class: Extended Part; Datasheet: https://atta.szlcsc.com/upload/public/pdf/source/20181015/C314256_034D87A5331B49D4E86F2A48D2519FC5.pdf; Supplier: LCSC; Convert to PCB: yes
L1 L2 = CBM160808U121T: Manufacturer: FH(风华); Add into BOM: yes; Impedance @ Frequency: 120Ω@100MHz; Tolerance: ±25%; DC Resistance: 65mΩ; Current Rating: 2A; Circuits: 1; Name: CBM160808U121T; Symbol: CBM160808U121T; Device: CBM160808U121T; LCSC Part Name: 120Ω@100MHz ±25%; Supplier Part: C62708; Manufacturer Part: CBM160808U121T; Supplier Footprint: 0603; JLCPCB Part Class: Extended Part; Datasheet: https://atta.szlcsc.com/upload/public/pdf/source/20151203/1457707610455.pdf; Supplier: LCSC; Convert to PCB: yes
LED2-LED5 = 17-21SYGC/S530-E3/TR8: Manufacturer: EVERLIGHT(亿光); Add into BOM: yes; Illumination Color: 普绿/黄绿; Luminous Intensity (IF=20mA): 32mcd; Dominant Wavelength / Coordinate rank: 573nm; Name: 17-21SYGC/S530-E3/TR8; Symbol: 17-21SYGC/S530-E3/TR8; Device: 17-21SYGC/S530-E3/TR8; LCSC Part Name: 普绿/黄绿LED，贴片; Supplier Part: C142303; Manufacturer Part: 17-21SYGC/S530-E3/TR8; Supplier Footprint: 0805; JLCPCB Part Class: Extended Part; Datasheet: https://atta.szlcsc.com/upload/public/pdf/source/20171110/C142303_15102792667121104246.pdf; Supplier: LCSC; Convert to PCB: yes; Mounting Type: 表面贴装; Correlated Color Temperature - CCT(K): -; Luminous Flux/Radiant Flux: -
R3 R9 R10 R19-R21 R26-R28 R30-R32 R35-R43 R45-R49 R51 R53-R55 = 0603WAF5113T5E: as R2 on sheet Peripheral2; Symbol: 0603WAF5113T5E; Device: 0603WAF5113T5E; LCSC Part Name: 511kΩ ±1% 100mW; Supplier Part: C23194; Manufacturer Part: 0603WAF5113T5E; Supplier Footprint: 0603; JLCPCB Part Class: Extended Part; Datasheet: https://atta.szlcsc.com/upload/public/pdf/source/20200306/C422600_1E6D84923E4A46A82E41ADD87F860B5C.pdf; Supplier: LCSC; Convert to PCB: yes; Type: 厚膜电阻; Operating Temperature Range: -55℃~+155℃
  R3 R9 R10 R39-R43 R45-R49 R54 R55: Name: 10kΩ
  R19-R21 R26-R28 R30-R32 R35-R38 R51 R53: Name: 22Ω
R15 R23 = R0603: as R1 on sheet Peripheral2; Device: RC0805FR-0768RL; LCSC Part Name: 68Ω ±1% 125mW; Supplier Part: C137498; Manufacturer Part: RC0805FR-0768RL; Supplier Footprint: 0805; JLCPCB Part Class: Extended Part; Datasheet: https://atta.szlcsc.com/upload/public/pdf/source/20171106/C137498_15099604779991093655.pdf; Supplier: LCSC; Convert to PCB: yes; Type: 厚膜电阻; Operating Temperature Range: -55℃~+125℃
U3 = IS64WV51216BLL-10MA3
U12-U14 U19 = 0603L035YR: as U7 on sheet Peripheral2; Name: 0603L035YR; Symbol: 0603L035YR; Device: 0603L035YR; Supplier Part: C207013; Manufacturer Part: 0603L035YR; Supplier Footprint: 0603; JLCPCB Part Class: Extended Part; Datasheet: https://atta.szlcsc.com/upload/public/pdf/source/20180709/C207013_44786F09EAFC890D8A7C29FA56404C7F.pdf; Supplier: LCSC; Convert to PCB: yes; Power Dissipation: -; Operating Temperature: -40℃~+85℃
U?#1 = STM32F407ZET6: Manufacturer: ST(意法半导体); Add into BOM: yes; CPU Core: ARM Cortex-M4; Maximum Frequency: 168MHZ; Supply Voltage Range: 1.8V~3.6V; Program FLASH Size: 1MB; Internal Oscillator: 有; RAM Size: 192KB; DAC (Units/Channels/bits): 1@x24ch/12bit; ADC (Units/Channels/bits): 1@x2ch/12bit; Peripherals / Functions / Protocol Stacks: 欠压检测/复位；DMA；LCD驱动；看门狗；POR；PWM; GPIO Ports Number: 114; Name: STM32F407ZGT6; Symbol: STM32F407ZGT6; Device: STM32F407ZGT6; LCSC Part Name: C19156; Manufacturer Part: STM32F407ZGT6; Supplier Footprint: LQFP-144_20x20x05P; JLCPCB Part Class: Extended Part; Supplier: LCSC; Convert to PCB: yes; EEPROM/Data FLASH Size: -; Operating Temperature Range: -40℃~+85℃; Datasheet: https://atta.szlcsc.com/upload/public/pdf/source/20140724/1457707162528.pdf
U?#2 = STM32F407ZET6: Manufacturer: ST(意法半导体); Add into BOM: yes; CPU Core: ARM Cortex-M4; Maximum Frequency: 168MHz; Supply Voltage Range: 1.8V~3.6V; Internal Oscillator: 有; Program FLASH Size: 1MB; RAM Size: 192KB; GPIO Ports Number: 114; ADC (Units/Channels/bits): 1@x24ch/12bit; DAC (Units/Channels/bits): 1@x2ch/12bit; Peripherals / Functions / Protocol Stacks: 欠压检测/复位；DMA；LCD驱动；看门狗；POR；PWM; Name: STM32F407ZGT6; Symbol: STM32F407ZGT6; Device: STM32F407ZGT6; LCSC Part Name: C19156; Manufacturer Part: STM32F407ZGT6; Supplier Footprint: LQFP-144_20x20x05P; JLCPCB Part Class: Extended Part; Supplier: LCSC; Convert to PCB: yes; EEPROM/Data FLASH Size: -; Operating Temperature Range: -40℃~+85℃; Datasheet: https://atta.szlcsc.com/upload/public/pdf/source/20140724/1457707162528.pdf
X1 = X32258MSB4SI: Manufacturer: YXC(扬兴晶振); Name: 8MHz; Add into BOM: yes; Crystal Type: 贴片无源晶振; Value: 8MHz; Frequency Tolerance: ±10ppm; Frequency Stability: ±30ppm; Load Capacitance: 20pF; Symbol: X32258MSB4SI; Device: X32258MSB4SI; LCSC Part Name: 8MHz ±10ppm 20pF; Supplier Part: C2682774; Manufacturer Part: X32258MSB4SI; Supplier Footprint: SMD3225-4P; JLCPCB Part Class: Extended Part; Datasheet: https://atta.szlcsc.com/upload/public/pdf/source/20210106/C2682774_0CD4FDA5D9DA3FBEEC23BD607A48E4B0.pdf; Supplier: LCSC; Convert to PCB: yes; Operating Temperature: -40℃~+85℃
X2 = X321532768KGD2SI: Manufacturer: YXC(扬兴晶振); Add into BOM: yes; Crystal Type: 贴片无源晶振; Value: 32.768kHz; Frequency Tolerance: ±20ppm; Load Capacitance: 12.5pF; Symbol: X321532768KGD2SI; Device: X321532768KGD2SI; LCSC Part Name: YST310S 32.768kHz ±20ppm 12.5pF; Supplier Part: C620155; Manufacturer Part: X321532768KGD2SI; Supplier Footprint: SMD3215-2P; JLCPCB Part Class: Extended Part; Datasheet: https://atta.szlcsc.com/upload/public/pdf/source/20210329/C620155_E5A74FC0D27C5E9015A8D75DE9484FEA.pdf; Supplier: LCSC; Convert to PCB: yes; Operating Temperature: -40℃~+85℃

## Nets that join several sheets
3V3: Peripheral2 (38 pins), MainMaster (47 pins)
5V: Peripheral2 (19 pins), MainMaster (U19.1)
AGND: Peripheral2 (64 pins), MainMaster (66 pins)
PA11_CAN1_RX: Peripheral2 (U9.4), MainMaster (U?#1.103)
PA12_CAN1_TX: Peripheral2 (U9.1), MainMaster (U?#1.104)
PB10_USART3_TX: Peripheral2 (R18.2), MainMaster (U?#1.69)
PB11_USART3_RX: Peripheral2 (R22.2), MainMaster (U?#1.70)
PB12_SPI2_NSS: Peripheral2 (CN7.4 R56.2 U22.1), MainMaster (U?#1.73)
PB13_SPI2_SCK: Peripheral2 (CN7.5 U22.6), MainMaster (U?#1.74)
PC2_SPI2_MISO: Peripheral2 (CN7.6 U22.2), MainMaster (U?#1.28)
PC3_SPI2_MOSI: Peripheral2 (CN7.3 U22.5), MainMaster (U?#1.29)
PC6_USART6_TX: Peripheral2 (U5.4), MainMaster (U?#1.96)
PC7_USART6_RX: Peripheral2 (U5.1), MainMaster (U?#1.97)
PC8_485_CTR: Peripheral2 (U5.2 U5.3), MainMaster (U?#1.98)